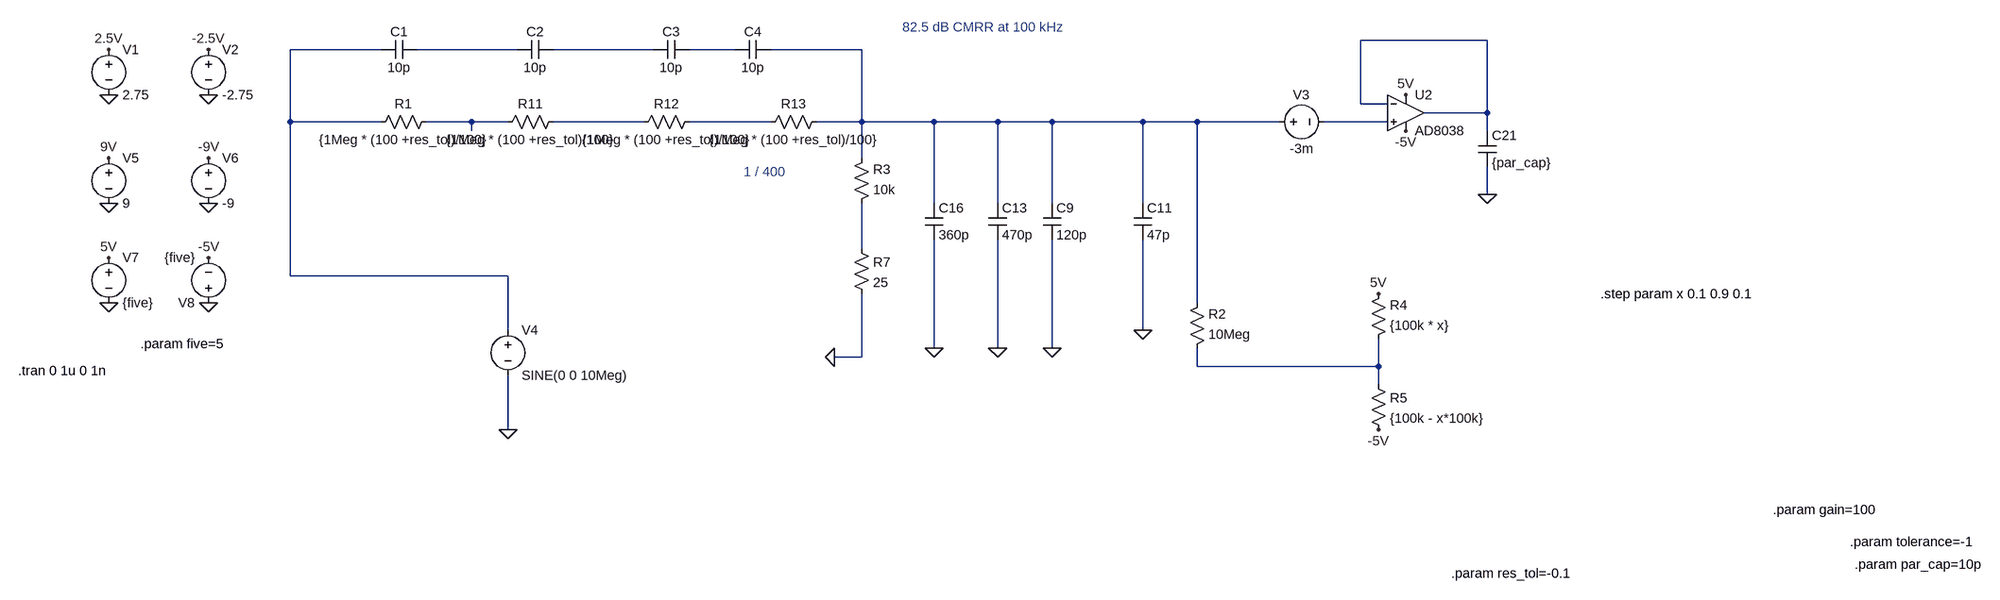
[diagram p0: schematic 910_offset_calibration.asc]
910_offset_calibration.asc, the LTspice schematic file:
Version 4
SHEET 1 1828 680
WIRE 896 -1728 672 -1728
WIRE -1056 -1712 -1216 -1712
WIRE -816 -1712 -992 -1712
WIRE -576 -1712 -752 -1712
WIRE -432 -1712 -512 -1712
WIRE -208 -1712 -368 -1712
WIRE 672 -1616 672 -1728
WIRE 720 -1616 672 -1616
WIRE 896 -1600 896 -1728
WIRE 896 -1600 784 -1600
WIRE -1216 -1584 -1216 -1712
WIRE -1056 -1584 -1216 -1584
WIRE -896 -1584 -976 -1584
WIRE -832 -1584 -896 -1584
WIRE -592 -1584 -752 -1584
WIRE -368 -1584 -512 -1584
WIRE -208 -1584 -208 -1712
WIRE -208 -1584 -288 -1584
WIRE -80 -1584 -208 -1584
WIRE 32 -1584 -80 -1584
WIRE 128 -1584 32 -1584
WIRE 288 -1584 128 -1584
WIRE 384 -1584 288 -1584
WIRE 528 -1584 384 -1584
WIRE 720 -1584 608 -1584
WIRE -896 -1568 -896 -1584
WIRE 896 -1568 896 -1600
WIRE -208 -1520 -208 -1584
WIRE 896 -1456 896 -1504
WIRE -80 -1440 -80 -1584
WIRE 32 -1440 32 -1584
WIRE 128 -1440 128 -1584
WIRE 288 -1440 288 -1584
WIRE -208 -1360 -208 -1440
WIRE -1216 -1312 -1216 -1584
WIRE -832 -1312 -1216 -1312
WIRE 384 -1264 384 -1584
WIRE -832 -1216 -832 -1312
WIRE 288 -1216 288 -1376
WIRE -80 -1184 -80 -1376
WIRE 32 -1184 32 -1376
WIRE 128 -1184 128 -1376
WIRE -208 -1168 -208 -1280
WIRE -208 -1168 -256 -1168
WIRE 384 -1152 384 -1184
WIRE 704 -1152 704 -1200
WIRE 704 -1152 384 -1152
WIRE 704 -1120 704 -1152
WIRE -832 -1040 -832 -1136
FLAG -1536 -1632 0
FLAG -1536 -1712 2.5V
FLAG -1360 -1632 0
FLAG -1360 -1712 -2.5V
FLAG -256 -1168 0
FLAG 128 -1184 0
FLAG 288 -1216 0
FLAG 752 -1632 5V
FLAG 752 -1568 -5V
FLAG -832 -1040 0
FLAG 32 -1184 0
FLAG -1536 -1440 0
FLAG -1536 -1520 9V
FLAG -1360 -1440 0
FLAG -1360 -1520 -9V
FLAG -1536 -1264 0
FLAG -1536 -1344 5V
FLAG -1360 -1264 0
FLAG -1360 -1344 -5V
FLAG -80 -1184 0
FLAG 896 -1456 0
FLAG 704 -1280 5V
FLAG 704 -1040 -5V
SYMBOL voltage -1536 -1728 R0
SYMATTR InstName V1
SYMATTR Value 2.75
SYMBOL voltage -1360 -1728 R0
SYMATTR InstName V2
SYMATTR Value -2.75
SYMBOL res -960 -1600 R90
WINDOW 0 0 56 VBottom 2
WINDOW 3 32 56 VTop 2
SYMATTR InstName R1
SYMATTR Value {1Meg * (100 +res_tol)/100}
SYMBOL cap -992 -1728 R90
WINDOW 0 0 32 VBottom 2
WINDOW 3 32 32 VTop 2
SYMATTR InstName C1
SYMATTR Value 10p
SYMBOL cap -752 -1728 R90
WINDOW 0 0 32 VBottom 2
WINDOW 3 32 32 VTop 2
SYMATTR InstName C2
SYMATTR Value 10p
SYMBOL cap -512 -1728 R90
WINDOW 0 0 32 VBottom 2
WINDOW 3 32 32 VTop 2
SYMATTR InstName C3
SYMATTR Value 10p
SYMBOL cap -368 -1728 R90
WINDOW 0 0 32 VBottom 2
WINDOW 3 32 32 VTop 2
SYMATTR InstName C4
SYMATTR Value 10p
SYMBOL cap 112 -1440 R0
SYMATTR InstName C9
SYMATTR Value 120p
SYMBOL cap 272 -1440 R0
SYMATTR InstName C11
SYMATTR Value 47p
SYMBOL res -224 -1424 M180
WINDOW 0 36 76 Left 2
WINDOW 3 36 40 Left 2
SYMATTR InstName R3
SYMATTR Value 10k
SYMBOL voltage -832 -1232 R0
WINDOW 123 0 0 Left 0
WINDOW 39 0 0 Left 0
SYMATTR InstName V4
SYMATTR Value SINE(0 0 10Meg)
SYMBOL cap 16 -1440 R0
SYMATTR InstName C13
SYMATTR Value 470p
SYMBOL voltage -1536 -1536 R0
SYMATTR InstName V5
SYMATTR Value 9
SYMBOL voltage -1360 -1536 R0
SYMATTR InstName V6
SYMATTR Value -9
SYMBOL voltage -1536 -1360 R0
SYMATTR InstName V7
SYMATTR Value {five}
SYMBOL voltage -1360 -1248 R180
WINDOW 123 0 0 Left 0
WINDOW 39 0 0 Left 0
SYMATTR InstName V8
SYMATTR Value {five}
SYMBOL OpAmps\\AD8038 752 -1664 R0
SYMATTR InstName U2
SYMBOL res -224 -1376 R0
SYMATTR InstName R7
SYMATTR Value 25
SYMBOL cap -96 -1440 R0
SYMATTR InstName C16
SYMATTR Value 360p
SYMBOL cap 880 -1568 R0
SYMATTR InstName C21
SYMATTR Value {par_cap}
SYMBOL res -736 -1600 R90
WINDOW 0 0 56 VBottom 2
WINDOW 3 32 56 VTop 2
SYMATTR InstName R11
SYMATTR Value {1Meg * (100 +res_tol)/100}
SYMBOL res -496 -1600 R90
WINDOW 0 0 56 VBottom 2
WINDOW 3 32 56 VTop 2
SYMATTR InstName R12
SYMATTR Value {1Meg * (100 +res_tol)/100}
SYMBOL res -272 -1600 R90
WINDOW 0 0 56 VBottom 2
WINDOW 3 32 56 VTop 2
SYMATTR InstName R13
SYMATTR Value {1Meg * (100 +res_tol)/100}
SYMBOL res 368 -1168 M180
WINDOW 0 36 76 Left 2
WINDOW 3 36 40 Left 2
SYMATTR InstName R2
SYMATTR Value 10Meg
SYMBOL res 688 -1184 M180
WINDOW 0 36 76 Left 2
WINDOW 3 36 40 Left 2
SYMATTR InstName R4
SYMATTR Value {100k * x}
SYMBOL res 688 -1136 R0
SYMATTR InstName R5
SYMATTR Value {100k - x*100k}
SYMBOL voltage 512 -1584 R270
WINDOW 0 32 56 VTop 2
WINDOW 3 -32 56 VBottom 2
WINDOW 123 0 0 Left 0
WINDOW 39 0 0 Left 0
SYMATTR InstName V3
SYMATTR Value -3m
TEXT -1696 -1144 Left 2 !.tran 0 1u 0 1n
TEXT -416 -1496 Left 2 ;1 / 400
TEXT -1480 -1192 Left 2 !.param five=5
TEXT -136 -1752 Left 2 ;82.5 dB CMRR at 100 kHz
TEXT 1536 -712 Left 2 !.param tolerance=-1
TEXT 1544 -672 Left 2 !.param par_cap=10p
TEXT 832 -656 Left 2 !.param res_tol=-0.1
TEXT 1400 -768 Left 2 !.param gain=100
TEXT 1096 -1280 Left 2 !.step param x 0.1 0.9 0.1

The netlist it stands for:
* 910_offset_calibration.asc
V1 2.5V 0 2.75
V2 -2.5V 0 -2.75
R1 N007 N002 {1Meg * (100 +res_tol)/100}
C1 N003 N002 10p
C2 N004 N003 10p
C3 N005 N004 10p
C4 N006 N005 10p
C9 N006 0 120p
C11 N006 0 47p
R3 N011 N006 10k
V4 N002 0 SINE(0 0 10Meg)
C13 N006 0 470p
V5 9V 0 9
V6 -9V 0 -9
V7 5V 0 {five}
V8 0 -5V {five}
XU2 N010 N001 5V -5V N001 AD8038  ; pins In+ In- V+ V- OUT
R7 N011 0 25
C16 N006 0 360p
C21 N001 0 {par_cap}
R11 N008 N007 {1Meg * (100 +res_tol)/100}
R12 N009 N008 {1Meg * (100 +res_tol)/100}
R13 N006 N009 {1Meg * (100 +res_tol)/100}
R2 N012 N006 10Meg
R4 N012 5V {100k * x}
R5 N012 -5V {100k - x*100k}
V3 N006 N010 -3m
.tran 0 1u 0 1n
* 1 / 400
.param five=5
* 82.5 dB CMRR at 100 kHz
.param tolerance=-1
.param par_cap=10p
.param res_tol=-0.1
.param gain=100
.step param x 0.1 0.9 0.1
.backanno
.end